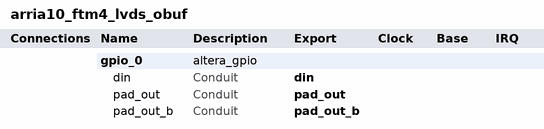
[diagram p0: system contents]
# Platform Designer (Qsys) system arria10_ftm4_lvds_obuf, Arria 10 10AX048E3F29E2SG
# Parameters at their usual value, and those the tool derives, are not listed.
package require -exact qsys 23.1
create_system arria10_ftm4_lvds_obuf
set_project_property DEVICE_FAMILY {Arria 10}
set_project_property DEVICE 10AX048E3F29E2SG

add_instance gpio_0 altera_gpio 23.1
set_instance_property gpio_0 AUTO_EXPORT true
set_instance_parameter_value gpio_0 EXT_DRIVER_PARAM false
set_instance_parameter_value gpio_0 GENERATE_SDC_FILE false
set_instance_parameter_value gpio_0 IP_MIGRATE_PORT_MAP_FILE altddio_bidir_port_map.csv
set_instance_parameter_value gpio_0 PIN_TYPE_GUI Output
set_instance_parameter_value gpio_0 SIZE 1
set_instance_parameter_value gpio_0 device_family {Arria 10}
set_instance_parameter_value gpio_0 gui_areset_mode None
set_instance_parameter_value gpio_0 gui_bus_hold false
set_instance_parameter_value gpio_0 gui_diff_buff true
set_instance_parameter_value gpio_0 gui_enable_cke false
set_instance_parameter_value gpio_0 gui_enable_migratable_port_names false
set_instance_parameter_value gpio_0 gui_enable_termination_ports false
set_instance_parameter_value gpio_0 gui_hr_logic false
set_instance_parameter_value gpio_0 gui_io_reg_mode none
set_instance_parameter_value gpio_0 gui_open_drain false
set_instance_parameter_value gpio_0 gui_pseudo_diff true
set_instance_parameter_value gpio_0 gui_separate_io_clks false
set_instance_parameter_value gpio_0 gui_sreset_mode None
set_instance_parameter_value gpio_0 gui_use_oe false

# exported interfaces
add_interface din conduit end
set_interface_property din EXPORT_OF gpio_0.din
add_interface pad_out conduit end
set_interface_property pad_out EXPORT_OF gpio_0.pad_out
add_interface pad_out_b conduit end
set_interface_property pad_out_b EXPORT_OF gpio_0.pad_out_b

set_interconnect_requirement {$system} qsys_mm.clockCrossingAdapter HANDSHAKE
set_interconnect_requirement {$system} qsys_mm.enableEccProtection FALSE
set_interconnect_requirement {$system} qsys_mm.insertDefaultSlave FALSE
set_interconnect_requirement {$system} qsys_mm.maxAdditionalLatency 1

save_system arria10_ftm4_lvds_obuf.qsys
